# Altium schematic sheet DAM16_Relays.SchDoc
size A3
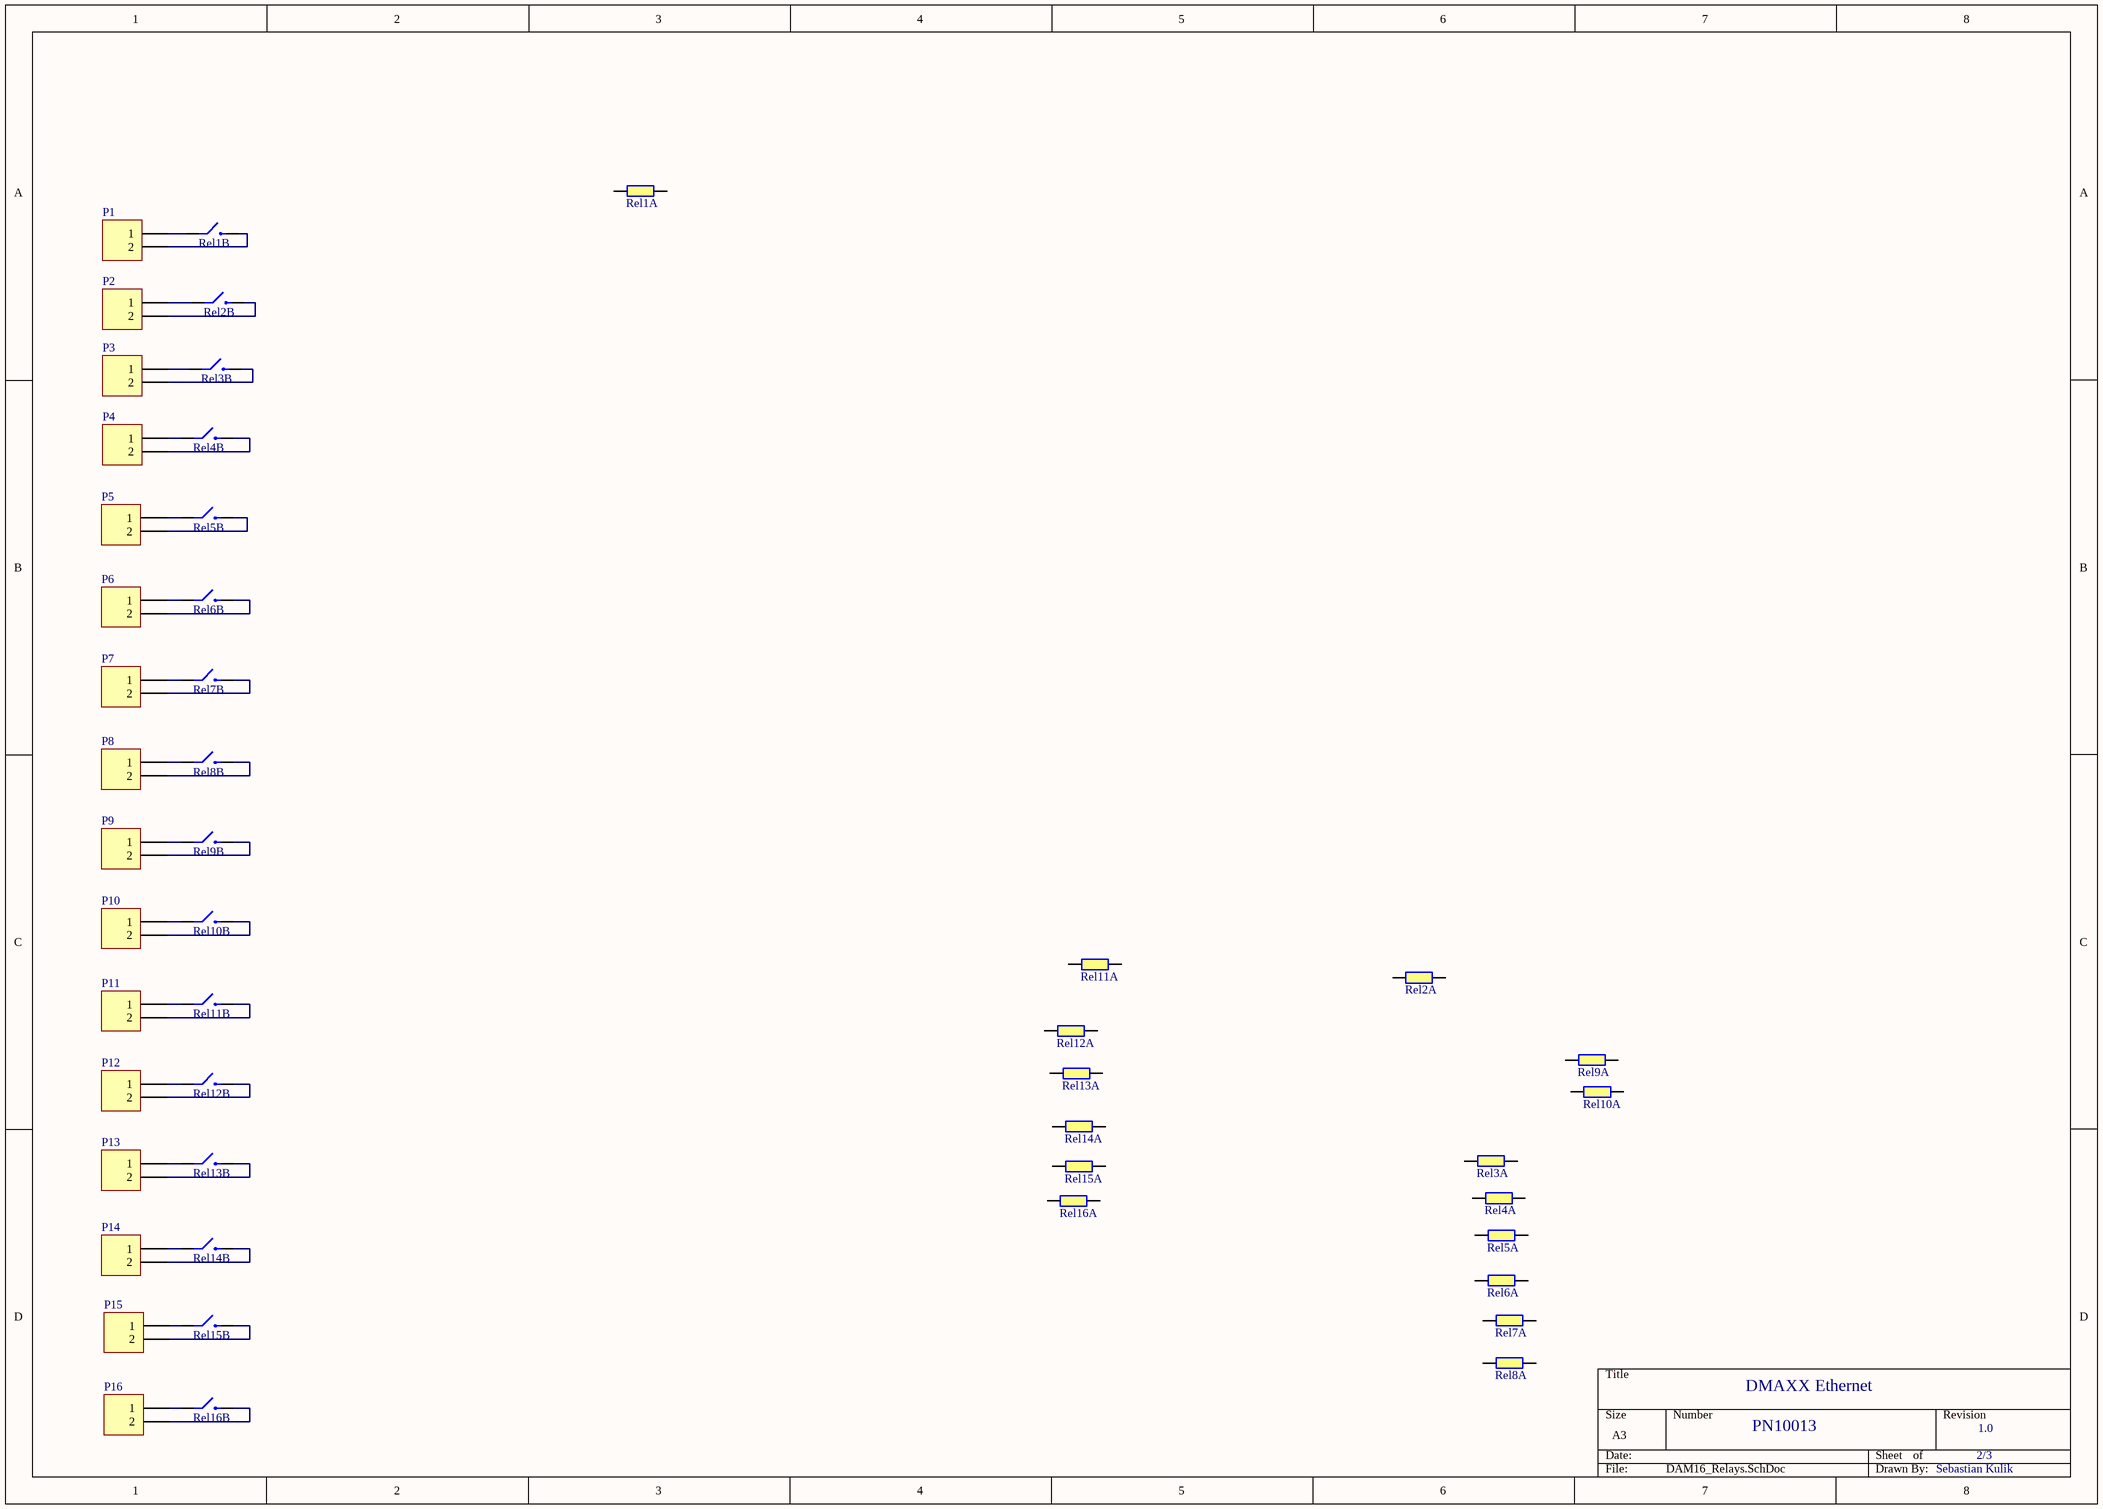
[diagram p0: DAM16_Relays.SchDoc]

## Parts
P1  PHOENIX_1715721  [Phoenix-2-5_08]  (value not drawn)
P2  PHOENIX_1715721  [Phoenix-2-5_08]  (value not drawn)
P3  PHOENIX_1715721  [Phoenix-2-5_08]  (value not drawn)
P4  PHOENIX_1715721  [Phoenix-2-5_08]  (value not drawn)
P5  PHOENIX_1715721  [Phoenix-2-5_08]  (value not drawn)
P6  PHOENIX_1715721  [Phoenix-2-5_08]  (value not drawn)
P7  PHOENIX_1715721  [Phoenix-2-5_08]  (value not drawn)
P8  PHOENIX_1715721  [Phoenix-2-5_08]  (value not drawn)
P9  PHOENIX_1715721  [Phoenix-2-5_08]  (value not drawn)
P10  PHOENIX_1715721  [Phoenix-2-5_08]  (value not drawn)
P11  PHOENIX_1715721  [Phoenix-2-5_08]  (value not drawn)
P12  PHOENIX_1715721  [Phoenix-2-5_08]  (value not drawn)
P13  PHOENIX_1715721  [Phoenix-2-5_08]  (value not drawn)
P14  PHOENIX_1715721  [Phoenix-2-5_08]  (value not drawn)
P15  PHOENIX_1715721  [Phoenix-2-5_08]  (value not drawn)
P16  PHOENIX_1715721  [Phoenix-2-5_08]  (value not drawn)
Rel1  Omron_G5RL-1A-E-HR  [Omron-G5RL-HR]  (value not drawn)  (parts A,B of 2)
Rel2  Omron_G5RL-1A-E-HR  [Omron-G5RL-HR]  (value not drawn)  (parts A,B of 2)
Rel3  Omron_G5RL-1A-E-HR  [Omron-G5RL-HR]  (value not drawn)  (parts A,B of 2)
Rel4  Omron_G5RL-1A-E-HR  [Omron-G5RL-HR]  (value not drawn)  (parts A,B of 2)
Rel5  Omron_G5RL-1A-E-HR  [Omron-G5RL-HR]  (value not drawn)  (parts A,B of 2)
Rel6  Omron_G5RL-1A-E-HR  [Omron-G5RL-HR]  (value not drawn)  (parts A,B of 2)
Rel7  Omron_G5RL-1A-E-HR  [Omron-G5RL-HR]  (value not drawn)  (parts A,B of 2)
Rel8  Omron_G5RL-1A-E-HR  [Omron-G5RL-HR]  (value not drawn)  (parts A,B of 2)
Rel9  Omron_G5RL-1A-E-HR  [Omron-G5RL-HR]  (value not drawn)  (parts A,B of 2)
Rel10  Omron_G5RL-1A-E-HR  [Omron-G5RL-HR]  (value not drawn)  (parts A,B of 2)
Rel11  Omron_G5RL-1A-E-HR  [Omron-G5RL-HR]  (value not drawn)  (parts A,B of 2)
Rel12  Omron_G5RL-1A-E-HR  [Omron-G5RL-HR]  (value not drawn)  (parts A,B of 2)
Rel13  Omron_G5RL-1A-E-HR  [Omron-G5RL-HR]  (value not drawn)  (parts A,B of 2)
Rel14  Omron_G5RL-1A-E-HR  [Omron-G5RL-HR]  (value not drawn)  (parts A,B of 2)
Rel15  Omron_G5RL-1A-E-HR  [Omron-G5RL-HR]  (value not drawn)  (parts A,B of 2)
Rel16  Omron_G5RL-1A-E-HR  [Omron-G5RL-HR]  (value not drawn)  (parts A,B of 2)

## Nets
NetP1_1: P1.1 Rel1.3
NetP1_2: P1.2 Rel1.4
NetP2_1: P2.1 Rel2.3
NetP2_2: P2.2 Rel2.4
NetP3_1: P3.1 Rel3.3
NetP3_2: P3.2 Rel3.4
NetP4_1: P4.1 Rel4.3
NetP4_2: P4.2 Rel4.4
NetP5_1: P5.1 Rel5.3
NetP5_2: P5.2 Rel5.4
NetP6_1: P6.1 Rel6.3
NetP6_2: P6.2 Rel6.4
NetP7_1: P7.1 Rel7.3
NetP7_2: P7.2 Rel7.4
NetP8_1: P8.1 Rel8.3
NetP8_2: P8.2 Rel8.4
NetP9_1: P9.1 Rel9.3
NetP9_2: P9.2 Rel9.4
NetP10_1: P10.1 Rel10.3
NetP10_2: P10.2 Rel10.4
NetP11_1: P11.1 Rel11.3
NetP11_2: P11.2 Rel11.4
NetP12_1: P12.1 Rel12.3
NetP12_2: P12.2 Rel12.4
NetP13_1: P13.1 Rel13.3
NetP13_2: P13.2 Rel13.4
NetP14_1: P14.1 Rel14.3
NetP14_2: P14.2 Rel14.4
NetP15_1: P15.1 Rel15.3
NetP15_2: P15.2 Rel15.4
NetP16_1: P16.1 Rel16.3
NetP16_2: P16.2 Rel16.4

Not connected (* = marked no-connect by the designer): Rel1 1 2; Rel2 1 2; Rel3 1 2; Rel4 1 2; Rel5 1 2; Rel6 1 2; Rel7 1 2; Rel8 1 2; Rel9 1 2; Rel10 1 2; Rel11 1 2; Rel12 1 2; Rel13 1 2; Rel14 1 2; Rel15 1 2; Rel16 1 2

## Notes on the sheet
- DMAXX Ethernet
- PN10013
- 2/3
- 1.0
- Sebastian Kulik

## Library data of the parts
P1-P16 = 2Pol_1715721: Phoenix, 2 pol, 5.08mm, 22A, 715721; Deliverer PartNr: 3041529; Deliverer: Farnell; TDE-PN: CON0008; LatestRevisionDate: 02.05.2014; LatestRevisionNote: Re-released for DXP Platform.; Publisher: Sebastian Kulik; Manufacturer PartNr: 1715721; Manufacturer: Phoenix
Rel1-Rel16 = Omron_G5RL-1A-E-HR: Omron_G5RL-1A-E-HR, 16A, 12V, 400mW; Deliverer PartNr: 2213807; Manufacturer PartNr: G5RL1AEHR12DC; Manufacturer: Finder; Deliverer: Farnell; TDE-PN: M0005; Published: 10.06.2014; PackageReference: Finder-43 series; Publisher: Sebastian Kulik